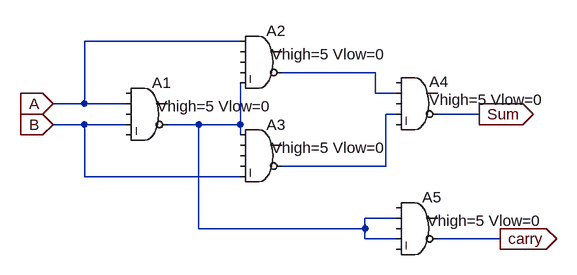
[diagram p0: schematic half_adder.asc]
half_adder.asc, the LTspice schematic file:
Version 4
SHEET 1 880 680
WIRE 288 -80 48 -80
WIRE 496 -32 352 -32
WIRE 496 0 496 -32
WIRE 528 0 496 0
WIRE 48 16 48 -80
WIRE 48 16 0 16
WIRE 112 16 48 16
WIRE 528 32 512 32
WIRE 656 32 592 32
WIRE 48 48 0 48
WIRE 112 48 48 48
WIRE 224 48 176 48
WIRE 288 48 288 -16
WIRE 288 48 224 48
WIRE 288 64 288 48
WIRE 512 112 512 32
WIRE 512 112 352 112
WIRE 48 128 48 48
WIRE 288 128 48 128
WIRE 528 192 480 192
WIRE 224 208 224 48
WIRE 480 208 480 192
WIRE 480 208 224 208
WIRE 480 224 480 208
WIRE 528 224 480 224
WIRE 688 224 592 224
FLAG 0 16 A
IOPIN 0 16 In
FLAG 0 48 B
IOPIN 0 48 In
FLAG 656 32 Sum
IOPIN 656 32 Out
FLAG 688 224 carry
IOPIN 688 224 Out
SYMBOL Digital\\and 144 -32 R0
WINDOW 3 16 52 Left 2
SYMATTR InstName A1
SYMATTR Value Vhigh=5 Vlow=0
SYMBOL Digital\\and 320 -112 R0
WINDOW 3 16 52 Left 2
SYMATTR InstName A2
SYMATTR Value Vhigh=5 Vlow=0
SYMBOL Digital\\and 320 32 R0
WINDOW 3 16 52 Left 2
SYMATTR InstName A3
SYMATTR Value Vhigh=5 Vlow=0
SYMBOL Digital\\and 560 -48 R0
WINDOW 0 19 30 Left 2
WINDOW 3 19 58 Left 2
SYMATTR InstName A4
SYMATTR Value Vhigh=5 Vlow=0
SYMBOL Digital\\and 560 144 R0
WINDOW 3 16 52 Left 2
SYMATTR InstName A5
SYMATTR Value Vhigh=5 Vlow=0

The netlist it stands for:
* half_adder.asc
A1 0 A 0 B 0 N003 0 0 AND Vhigh=5 Vlow=0
A2 A 0 0 0 N003 N001 0 0 AND Vhigh=5 Vlow=0
A3 N003 0 0 0 B N002 0 0 AND Vhigh=5 Vlow=0
A4 0 N001 0 N002 0 Sum 0 0 AND Vhigh=5 Vlow=0
A5 0 N003 0 N003 0 carry 0 0 AND Vhigh=5 Vlow=0
.backanno
.end